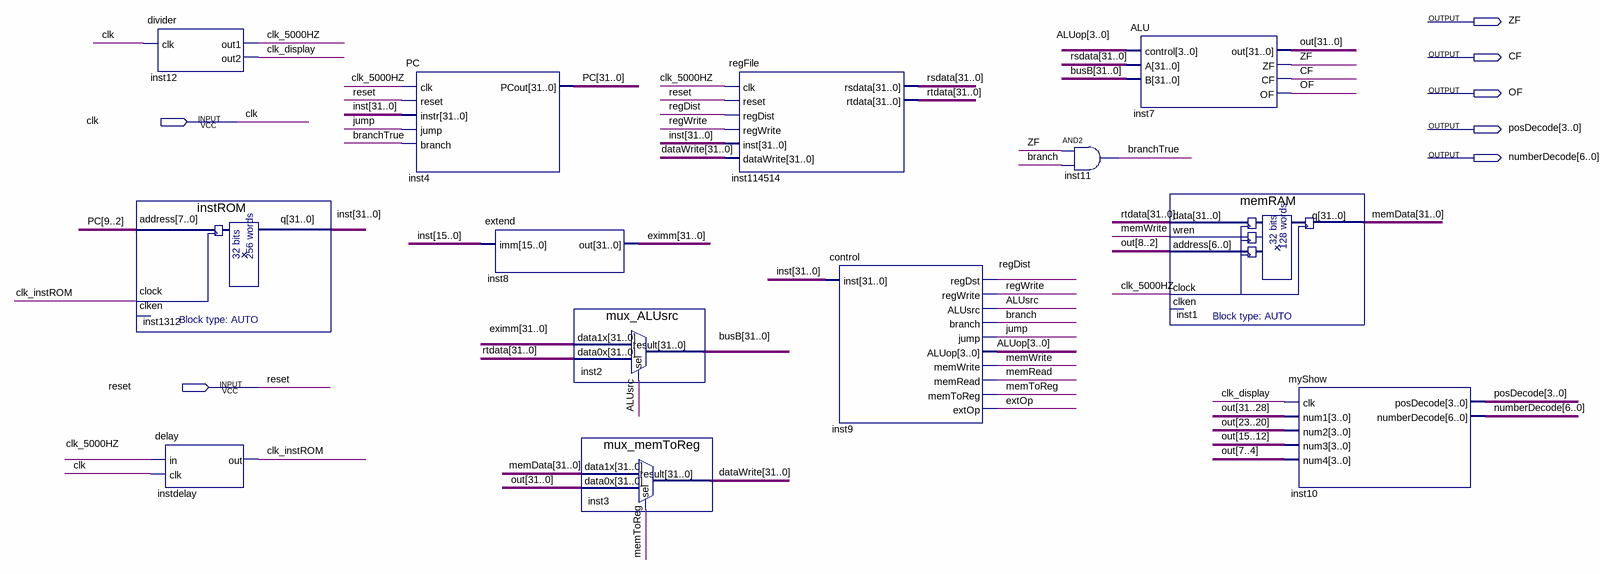
[diagram p0: schematic sheet]
// Quartus schematic top_final.bdf as structural Verilog: 13 symbols, 7 pins
module top_final (
  input  clk,
  input  reset,
  output ZF,
  output CF,
  output OF,
  output [3:0] posDecode,
  output [6:0] numberDecode
);

  wire ALUsrc, branch, branchTrue, clk_5000HZ, clk_display, clk_instROM, extOp, jump, memRead, memToReg,
       memWrite, regDist, regWrite;
  wire [3:0] ALUop;
  wire [31:0] busB, dataWrite, eximm, inst, memData, out, PC, rsdata, rtdata;

  instROM inst1312 (.address(PC[9:2]), .clock(clk_instROM), .q(inst));  // open: clken
  divider inst12 (.clk(clk), .out1(clk_5000HZ), .out2(clk_display));
  delay instdelay (.in(clk_5000HZ), .clk(clk), .out(clk_instROM));
  PC inst4 (.clk(clk_5000HZ), .reset(reset), .instr(inst), .jump(jump), .branch(branchTrue), .PCout(PC));
  extend inst8 (.imm(inst[15:0]), .out(eximm));
  mux_ALUsrc inst2 (.data1x(eximm), .data0x(rtdata), .sel(ALUsrc), .result(busB));
  mux_memToReg inst3 (.data1x(memData), .data0x(out), .sel(memToReg), .result(dataWrite));
  regFile inst114514 (
    .clk(clk_5000HZ), .reset(reset), .regDist(regDist), .regWrite(regWrite), .inst(inst),
    .dataWrite(dataWrite), .rsdata(rsdata), .rtdata(rtdata));
  control inst9 (
    .inst(inst), .regDst(regDist), .regWrite(regWrite), .ALUsrc(ALUsrc), .branch(branch), .jump(jump),
    .ALUop(ALUop), .memWrite(memWrite), .memRead(memRead), .memToReg(memToReg), .extOp(extOp));
  and inst11 (branchTrue, ZF, branch);
  ALU inst7 (.control(ALUop), .A(rsdata), .B(busB), .out(out), .ZF(ZF), .CF(CF), .OF(OF));
  memRAM inst1 (.data(rtdata), .wren(memWrite), .address(out[8:2]), .clock(clk_5000HZ), .q(memData));  // open: clken
  myShow inst10 (
    .clk(clk_display), .num1(out[31:28]), .num2(out[23:20]), .num3(out[15:12]), .num4(out[7:4]),
    .posDecode(posDecode), .numberDecode(numberDecode));
endmodule
